# Altium schematic sheet LM2596.SchDoc
size A
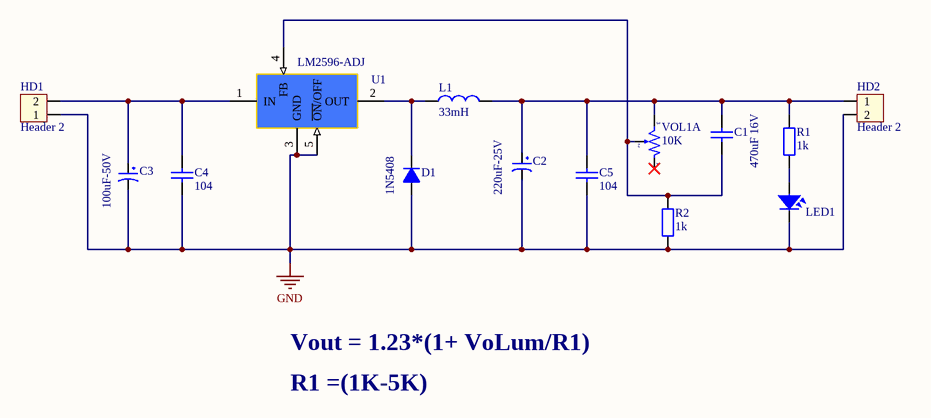
[diagram p0: LM2596.SchDoc]

## Parts
C1  470uF 16V  [tu gom]
C2  220uF-25V  [Tu hoa 8mm]
C3  100uF-50V  [tu hoa 8mm]
C4  104  [tu gom]
C5  104  [tu gom]
D1  1N5408  [D5A]
HD1  Header 2  [HED2]
HD2  Header 2  [HED2]
L1  33mH  [R1/4W]
LED1  LED  [LED-5-RED]  (value not drawn)
R1  1k  [R1/4W]
R2  1k  [R1/4W]
U1  LM2596-ADJ  [D2-PACK5]
VOL1  10K  [VR1]  (part A of 2)

## Nets
GND: C2.2 C3.2 C4.2 C5.2 D1.1(A) HD1.1 HD2.2 LED1.2 R2.1 U1.3(GND) U1.5(~{ON}/OFF)
NetC1_1: C1.1 C2.1 C5.1 HD2.1 L1.2 R1.2 VOL1.3
NetC1_2: C1.2 R2.2 U1.4(FB) VOL1.2
NetC3_1: C3.1 C4.1 HD1.2 U1.1(IN)
NetD1_2: D1.2(K) L1.1 U1.2(OUT)
NetLED1_1: LED1.1 R1.1

Not connected (* = marked no-connect by the designer): VOL1 1*

## Notes on the sheet
- Vout = 1.23*(1+ VoLum/R1)
- R1 =(1K-5K)

## Library data of the parts
C1 C4 C5 = Tu gom 100 50V: Cắm; Don_Vi: Con; So_Chan: 2; Ten_Linh_Kien: Tụ gốm 100 10pF 50V; Ma_Hang: MH004765; Chung_Loai: Cắm; Kieu_Chan: *
C2 = Tu Hoa 220uF 25V 8x10: Cắm; Don_Vi: Con; So_Chan: 2; Ten_Linh_Kien: Tụ Hóa 220uF 25V 8x10MM; Ma_Hang: MH006864; Chung_Loai: Cắm; Kieu_Chan: *
C3 = Tu Hoa 100uF 50V 8x11: Cắm; Don_Vi: Con; So_Chan: 2; Ten_Linh_Kien: Tụ Hóa 100uF 50V 8x11MM; Ma_Hang: MH006872; Chung_Loai: Cắm; Kieu_Chan: *
D1 = D5A: Diode 5A; Value: 1N5408
HD1 HD2 = Hed2: Header 2 (Green); Value: Header 2
L1 = Cuon cam 220uH: Cắm; So_Chan: 2; Ten_Linh_Kien: Cuộn Cảm 220uH 3A 8x10MM; Ma_Hang: MH002208; Don_Vi: Con; Chung_Loai: Cắm; Kieu_Chan: *
LED1 = LED: LED Single colour Green and Red; Value: LED 3 ly Single Colour
R1 R2 = R1/4W: Resistor 1/4W; Value: R1/4W - 1K
U1 = LM2596: Simple Switcher 3A Step Down Voltage Regulator; Note: Tab is connected to GND; Published: 15-Apr-2002; DatasheetVersion: May-1999; PackageVersion: 2000; PackageReference: T05A; Publisher: Altium Limited; PackageDescription: TO, Thru-Hole, Vertical, Heatsink Mounted; 5 In-Line Leads; Pitch 1.70 mm; Code_JEDEC: TS-001-AA; ComponentLink1Description: Manufacturer Link; ComponentLink1URL: http://www.national.com/; ComponentLink2Description: Datasheet; ComponentLink2URL: H:\LIBRARY\LIBRARY.Datasheet\LM2576.pdf; ComponentLink3Description: URL Link1; ComponentLink3URL: http://www.national.com/pf/LM/LM2575HV.html; Price: 15000 VND
VOL1 = VOL-D: Volume control Dual; Value: Volume Dual 50K